# EAGLE design RFM50_Breakout (EAGLE 6.3)
HopeRF's RFM50 Breakout-board This is the first prototyped version.
AUTHOR: Pasakorn Tiwatthanont
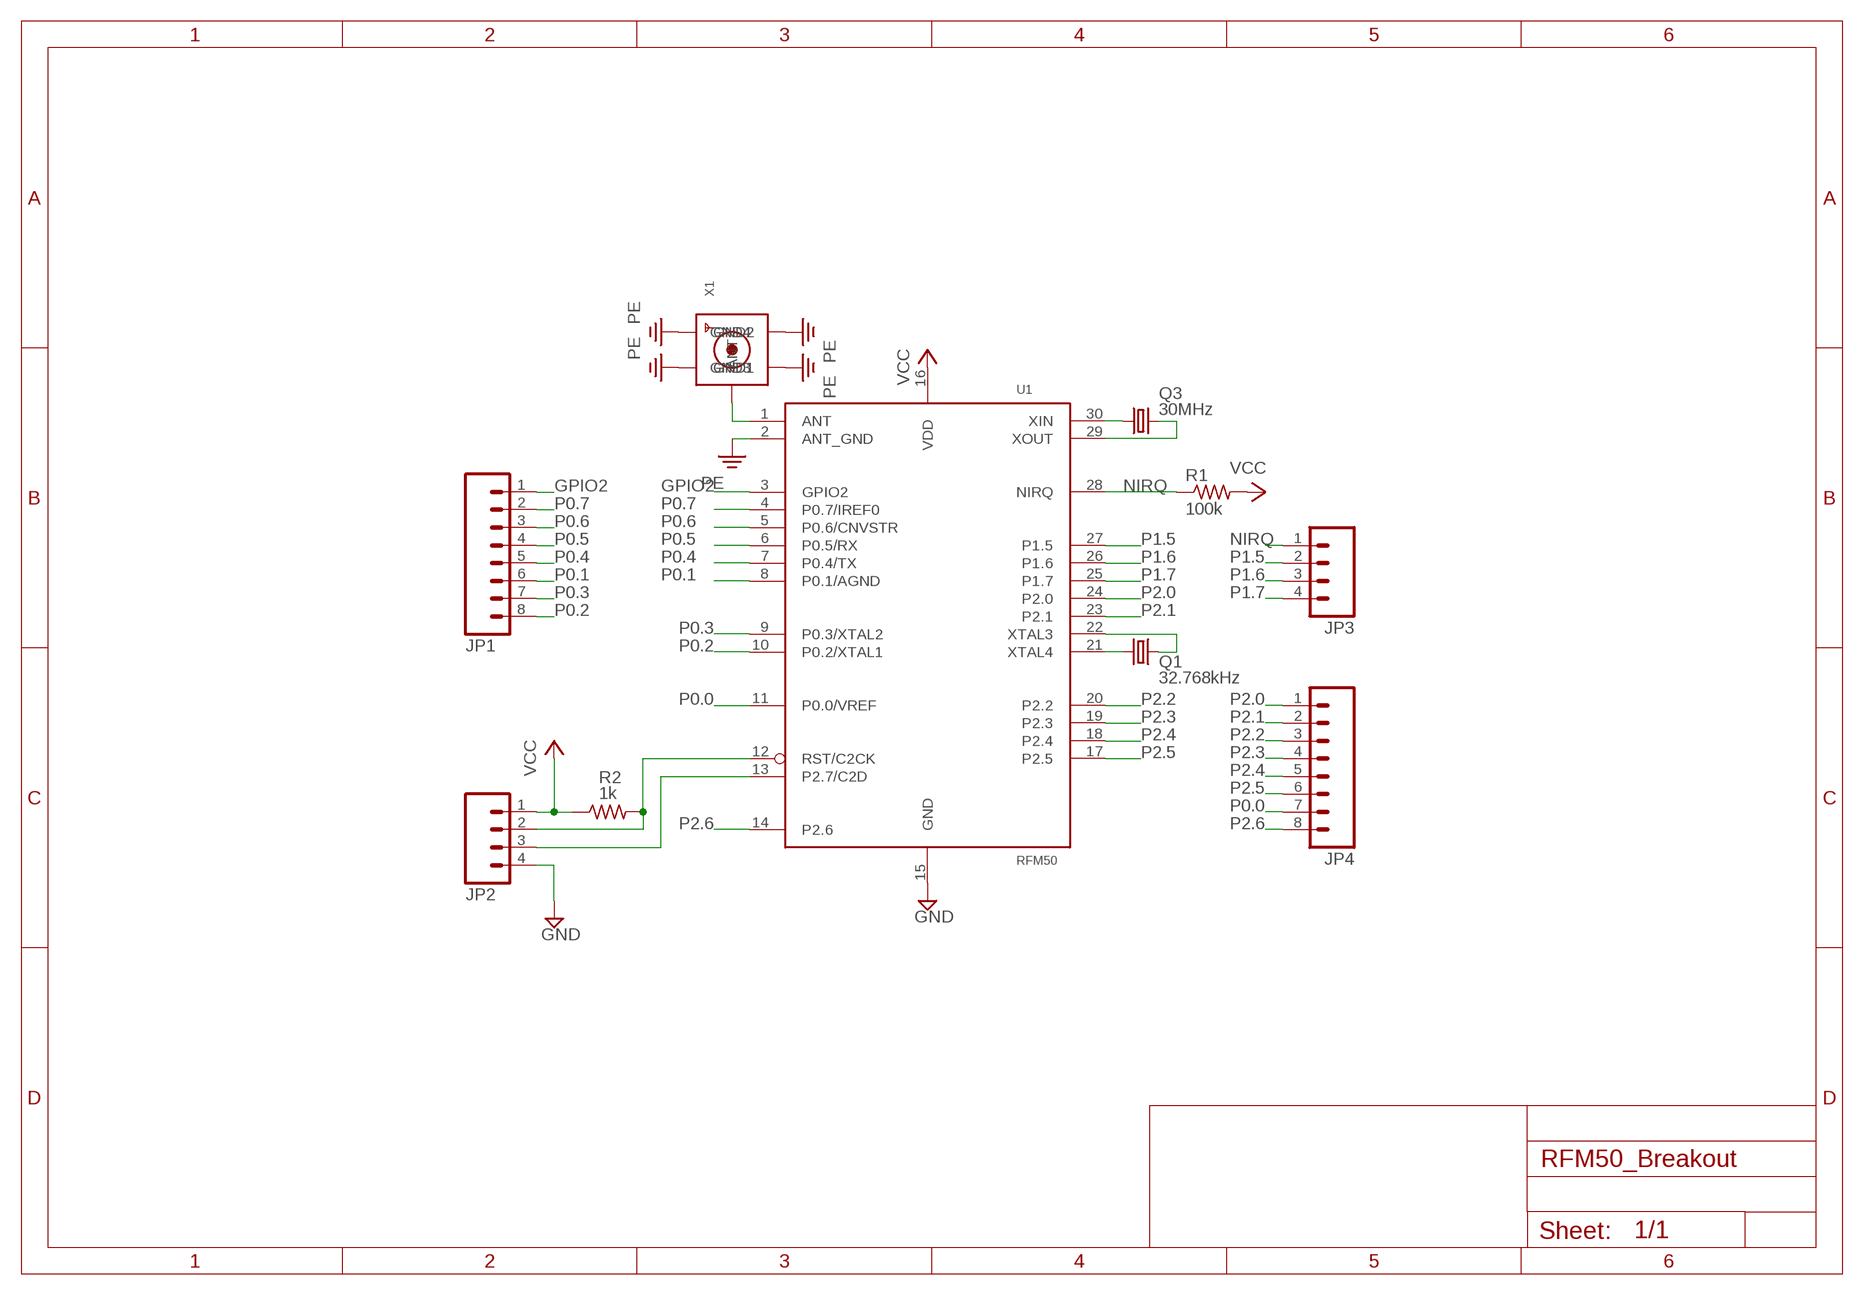
[diagram p0: schematic, sheet 1]

## Parts
JP1  M081X08  [1X08]
JP2  M04PTH  [1X04]
JP3  M04PTH  [1X04]
JP4  M081X08  [1X08]
Q1  32.768kHz  CRYSTALTC26H  [TC26H]
Q3  30MHz  CRYSTALHC49S  [HC49/S]
R1  100k  RCL_R-US_0204/2V  [RCL_0204V]
R2  1k  RCL_R-US_0204/2V  [RCL_0204V]
U1  RFM50  [RFM50]
X1  SMACONNECTOR  [SMA90_DIP]

## Nets
GND: JP2.4 U1.15(GND)
GPIO2: JP1.1 U1.3(GPIO2)
N$1: U1.1(ANT) X1.ANTENNA(ANT)
N$2: JP2.2 R2.2 U1.12(RST/C2CK)
N$4: Q3.1 U1.30(XIN)
N$5: Q3.2 U1.29(XOUT)
N$6: Q1.2 U1.21(XTAL4)
N$7: Q1.1 U1.22(XTAL3)
N$9: JP2.3 U1.13(P2.7/C2D)
NIRQ: JP3.1 R1.1 U1.28(NIRQ)
P0.0: JP4.7 U1.11(P0.0/VREF)
P0.1: JP1.6 U1.8(P0.1/AGND)
P0.2: JP1.8 U1.10(P0.2/XTAL1)
P0.3: JP1.7 U1.9(P0.3/XTAL2)
P0.4: JP1.5 U1.7(P0.4/TX)
P0.5: JP1.4 U1.6(P0.5/RX)
P0.6: JP1.3 U1.5(P0.6/CNVSTR)
P0.7: JP1.2 U1.4(P0.7/IREF0)
P1.5: JP3.2 U1.27(P1.5)
P1.6: JP3.3 U1.26(P1.6)
P1.7: JP3.4 U1.25(P1.7)
P2.0: JP4.1 U1.24(P2.0)
P2.1: JP4.2 U1.23(P2.1)
P2.2: JP4.3 U1.20(P2.2)
P2.3: JP4.4 U1.19(P2.3)
P2.4: JP4.5 U1.18(P2.4)
P2.5: JP4.6 U1.17(P2.5)
P2.6: JP4.8 U1.14(P2.6)
PE: U1.2(ANT_GND) X1.GND1 X1.GND2 X1.GND3 X1.GND4
VCC: JP2.1 R1.2 R2.1 U1.16(VDD)

## Library data of the parts
JP1 JP4 = SparkFun-Connectors:M08: Header 8 Standard 8-pin 0.1" header. Use with straight break away headers (SKU : PRT-00116), right angle break away headers (PRT-00553), swiss pins (PRT-00743), machine pins (PRT-00117), and female headers (PRT-00115).
JP2 JP3 = ipas:M04: Header 4 Standard 4-pin 0.1" header. Use with straight break away headers (SKU : PRT-00116), right angle break away headers (PRT-00553), swiss pins (PRT-00743), machine pins (PRT-00117), and female headers (PRT-00115). Molex polarized connector foot print use with SKU : PRT-08231 with associated crimp pins and housings. 1MM SMD Version SKU: PRT-10208
Q1 = crystal:CRYSTAL: CRYSTAL; OC_FARNELL: unknown; OC_NEWARK: unknown
Q3 = crystal:CRYSTAL: CRYSTAL; OC_FARNELL: 1667008; OC_NEWARK: unknown
R1 R2 = ipas:RCL_R-US_: RESISTOR, American symbol
U1 = ipas:RFM50: RFM50 Module for Silabs Wireless SoC, Si1000.
X1 = ipas:SMACONNECTOR: SMA Connector 90° DIP SMA Connector, 50 Ohm (4UConnector: 07259)

## Board
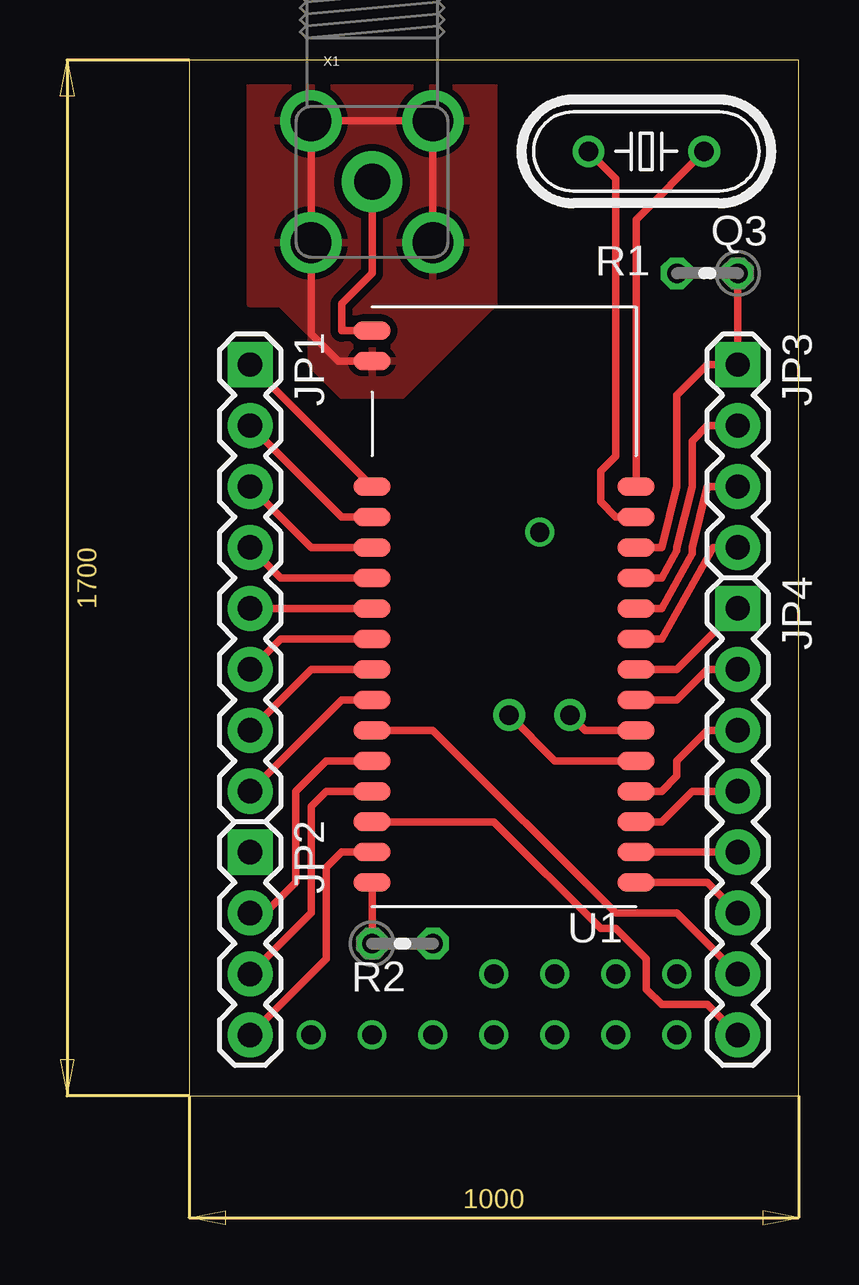
[diagram p1: board, top side]
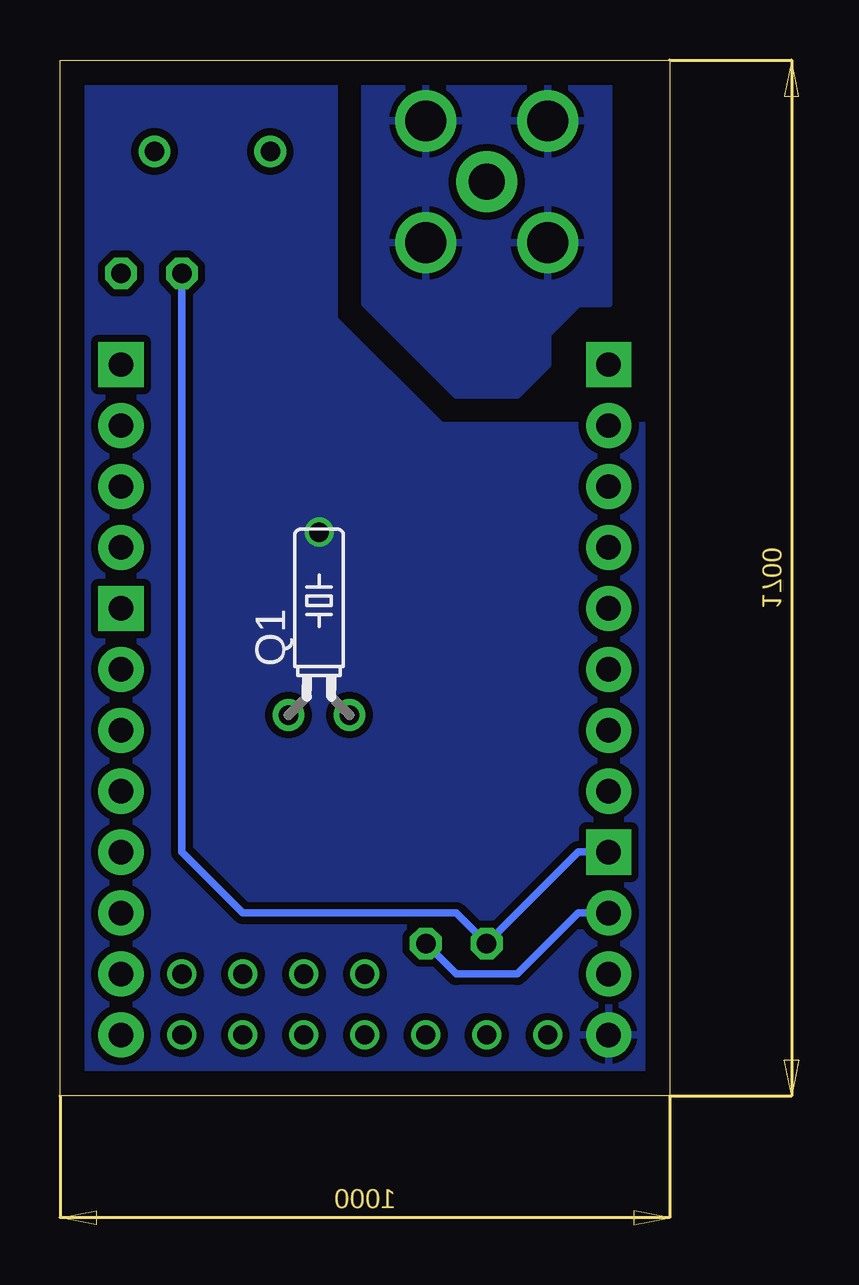
[diagram p2: board, bottom side, seen from below]

Size 25.4 x 43.18 mm. Coordinates in mm from the lower left corner, seen from the top.
Outline: 0,0 25.4,0 25.4,43.18 0,43.18 0,0
Copper layers (1*16): Top 0.035mm / dielectric 1.5mm / Bottom 0.035mm
Design rules "ipas": minimum track width 12mil, minimum drill 24mil, track to track 12mil, track to pad 12mil, pad to pad 10mil, via to via 10mil, smd to smd 10mil, copper to edge 40mil, drill to drill 10mil, minimum pad ring 10mil, minimum via ring 8mil, stop-mask expansion 4mil, vias tented up to drill 0mil, thermal gap 10mil

### Footprints (pad centres in the part's own frame; a part is rotated, then mirrored left to right if it is on the bottom)
1X08 = drill 1.016 pad 1.88 square: 1 0,0 | drill 1.016 pad 1.88: 2 2.54,0; 3 5.08,0; 4 7.62,0; 5 10.16,0; 6 12.7,0; 7 15.24,0; 8 17.78,0
1X04 = drill 1.016 pad 1.88 square: 1 0,0 | drill 1.016 pad 1.88: 2 2.54,0; 3 5.08,0; 4 7.62,0
TC26H = drill 0.813: 1 -1.27,0; 2 1.27,0
HC49/S = drill 0.813: 1 -2.413,0; 2 2.413,0
RCL_0204V = drill 0.813 octagon: 1 -1.27,0; 2 1.27,0
RFM50 = smd 1.524 x 0.762: 1 0,23; 2 0,21.73; 3 0,16.51; 4 0,15.24; 5 0,13.97; 6 0,12.7; 7 0,11.43; 8 0,10.16; 9 0,8.89; 10 0,7.62; 11 0,6.35; 12 0,5.08; 13 0,3.81; 14 0,2.54; 15 0,1.27; 16 0,0; 17 11,0; 18 11,1.27; 19 11,2.54; 20 11,3.81; 21 11,5.08; 22 11,6.35; 23 11,7.62; 24 11,8.89; 25 11,10.16; 26 11,11.43; 27 11,12.7; 28 11,13.97; 29 11,15.24; 30 11,16.51
SMA90_DIP = drill 1.5 pad 2.54: ANTENNA 0,0 | drill 1.7 pad 2.54: GND1 -2.54,2.54; GND2 2.54,2.54; GND3 -2.54,-2.54; GND4 2.54,-2.54

### Placement (x,y rotation side)
JP1  2.54,30.48 270 top
JP2  2.54,10.16 270 top
JP3  22.86,30.48 270 top
JP4  22.86,20.32 270 top
Q1  14.61,15.88 0 bottom
Q3  19.05,39.37 180 top
R1  21.59,34.29 180 top
R2  8.89,6.35 0 top
U1  7.62,8.89 0 top
X1  7.62,38.1 0 top

### Tracks (layer width: path | path; a pad name or v marks a point on that pad's centre or on a via)
GND  (via drill 0.8)
  Top 0.305: JP2.4 5.71,5.71 5.71,9.53 6.35,10.16 U1.15
  other vias: 14.61,23.5
  pour Bottom: 0,27.94 9.53,27.94 13.97,32.38 13.97,43.18 25.4,43.18 25.4,0 0,0
GPIO2
  Top 0.305: JP1.1 U1.3
N$1
  Top 0.305: U1.1 6.35,31.89 6.35,33.02 7.62,34.29 X1.ANTENNA
N$2
  Top 0.305: JP2.2 3.17,7.62 4.45,8.89 4.45,12.7 5.71,13.97 U1.12
  Bottom 0.305: JP2.2 3.81,7.62 6.35,5.08 8.89,5.08 R2.2
N$3  (via drill 0.8)
  other vias: 5.08,2.54
N$4
  Top 0.305: U1.30 18.62,36.53 Q3.1
N$5
  Top 0.305: U1.29 17.78,24.13 17.14,24.77 17.14,26.04 17.78,26.67 17.78,38.23 Q3.2
N$6
  Top 0.305: U1.21 15.24,13.97 Q1.2
N$7
  Top 0.305: U1.22 16.51,15.24 Q1.1
N$8  (via drill 0.8)
  other vias: 7.62,2.54
N$9
  Top 0.305: JP2.3 5.08,7.62 5.08,12.06 5.71,12.7 U1.13
N$10  (via drill 0.8)
  other vias: 10.16,2.54
N$11  (via drill 0.8)
  other vias: 12.7,2.54
N$12  (via drill 0.8)
  other vias: 15.24,2.54
N$13  (via drill 0.8)
  other vias: 17.78,2.54
N$14  (via drill 0.8)
  other vias: 15.24,5.08
N$15  (via drill 0.8)
  other vias: 12.7,5.08
N$16  (via drill 0.8)
  other vias: 17.78,5.08
N$17  (via drill 0.8)
  other vias: 20.32,2.54
N$18  (via drill 0.8)
  other vias: 20.32,5.08
NIRQ
  Top 0.305: R1.1 JP3.1 21.59,30.48 20.32,29.21 20.32,25.4 19.68,22.86 U1.28
P0.0
  Top 0.305: JP4.7 20.32,7.62 17.78,7.62 10.16,15.24 U1.11
P0.1
  Top 0.305: JP1.6 3.81,19.05 U1.8
P0.2
  Top 0.305: JP1.8 6.35,16.51 U1.10
P0.3
  Top 0.305: JP1.7 5.08,17.78 U1.9
P0.4
  Top 0.305: JP1.5 U1.7
P0.5
  Top 0.305: JP1.4 3.81,21.59 U1.6
P0.6
  Top 0.305: JP1.3 5.08,22.86 U1.5
P0.7
  Top 0.305: JP1.2 6.35,24.13 U1.4
P1.5
  Top 0.305: U1.27 19.68,21.59 20.32,22.73 20.32,22.86 20.95,25.4 20.95,27.3 21.59,27.94 JP3.2
P1.6
  Top 0.305: U1.26 19.68,20.32 20.95,22.61 20.95,22.86 21.59,25.4 JP3.3
P1.7
  Top 0.305: U1.25 19.68,19.05 21.84,22.86 JP3.4
P2.0
  Top 0.305: U1.24 20.32,17.78 JP4.1
P2.1
  Top 0.305: U1.23 20.32,16.51 21.59,17.78 JP4.2
P2.2
  Top 0.305: U1.20 19.68,12.7 20.32,13.34 20.32,13.97 21.59,15.24 JP4.3
P2.3
  Top 0.305: U1.19 19.68,11.43 20.95,12.7 JP4.4
P2.4
  Top 0.305: U1.18 JP4.5
P2.5
  Top 0.305: U1.17 21.59,8.89 JP4.6
P2.6
  Top 0.305: U1.14 12.7,11.43 17.14,6.99 17.78,6.99 19.05,5.71 19.05,4.45 19.68,3.81 21.59,3.81 JP4.8
PE
  Top 0.305: U1.2 6.21,30.62 5.08,31.75 X1.GND3 X1.GND1 X1.GND2 X1.GND4
  pour Top: 2.54,33.02 3.81,33.02 5.08,31.75 5.08,30.48 6.35,29.21 8.89,29.21 12.7,33.02 12.7,43.18 2.54,43.18
  pour Bottom: 2.54,33.02 3.81,33.02 5.08,31.75 5.08,30.48 6.35,29.21 8.89,29.21 12.7,33.02 12.7,43.18 2.54,43.18
VCC
  Top 0.305: U1.16 R2.1
  Bottom 0.305: R1.2 20.32,10.16 17.78,7.62 8.89,7.62 R2.1 3.81,10.16 JP2.1